# EAGLE design kivezérlés (EAGLE 6.5.0)
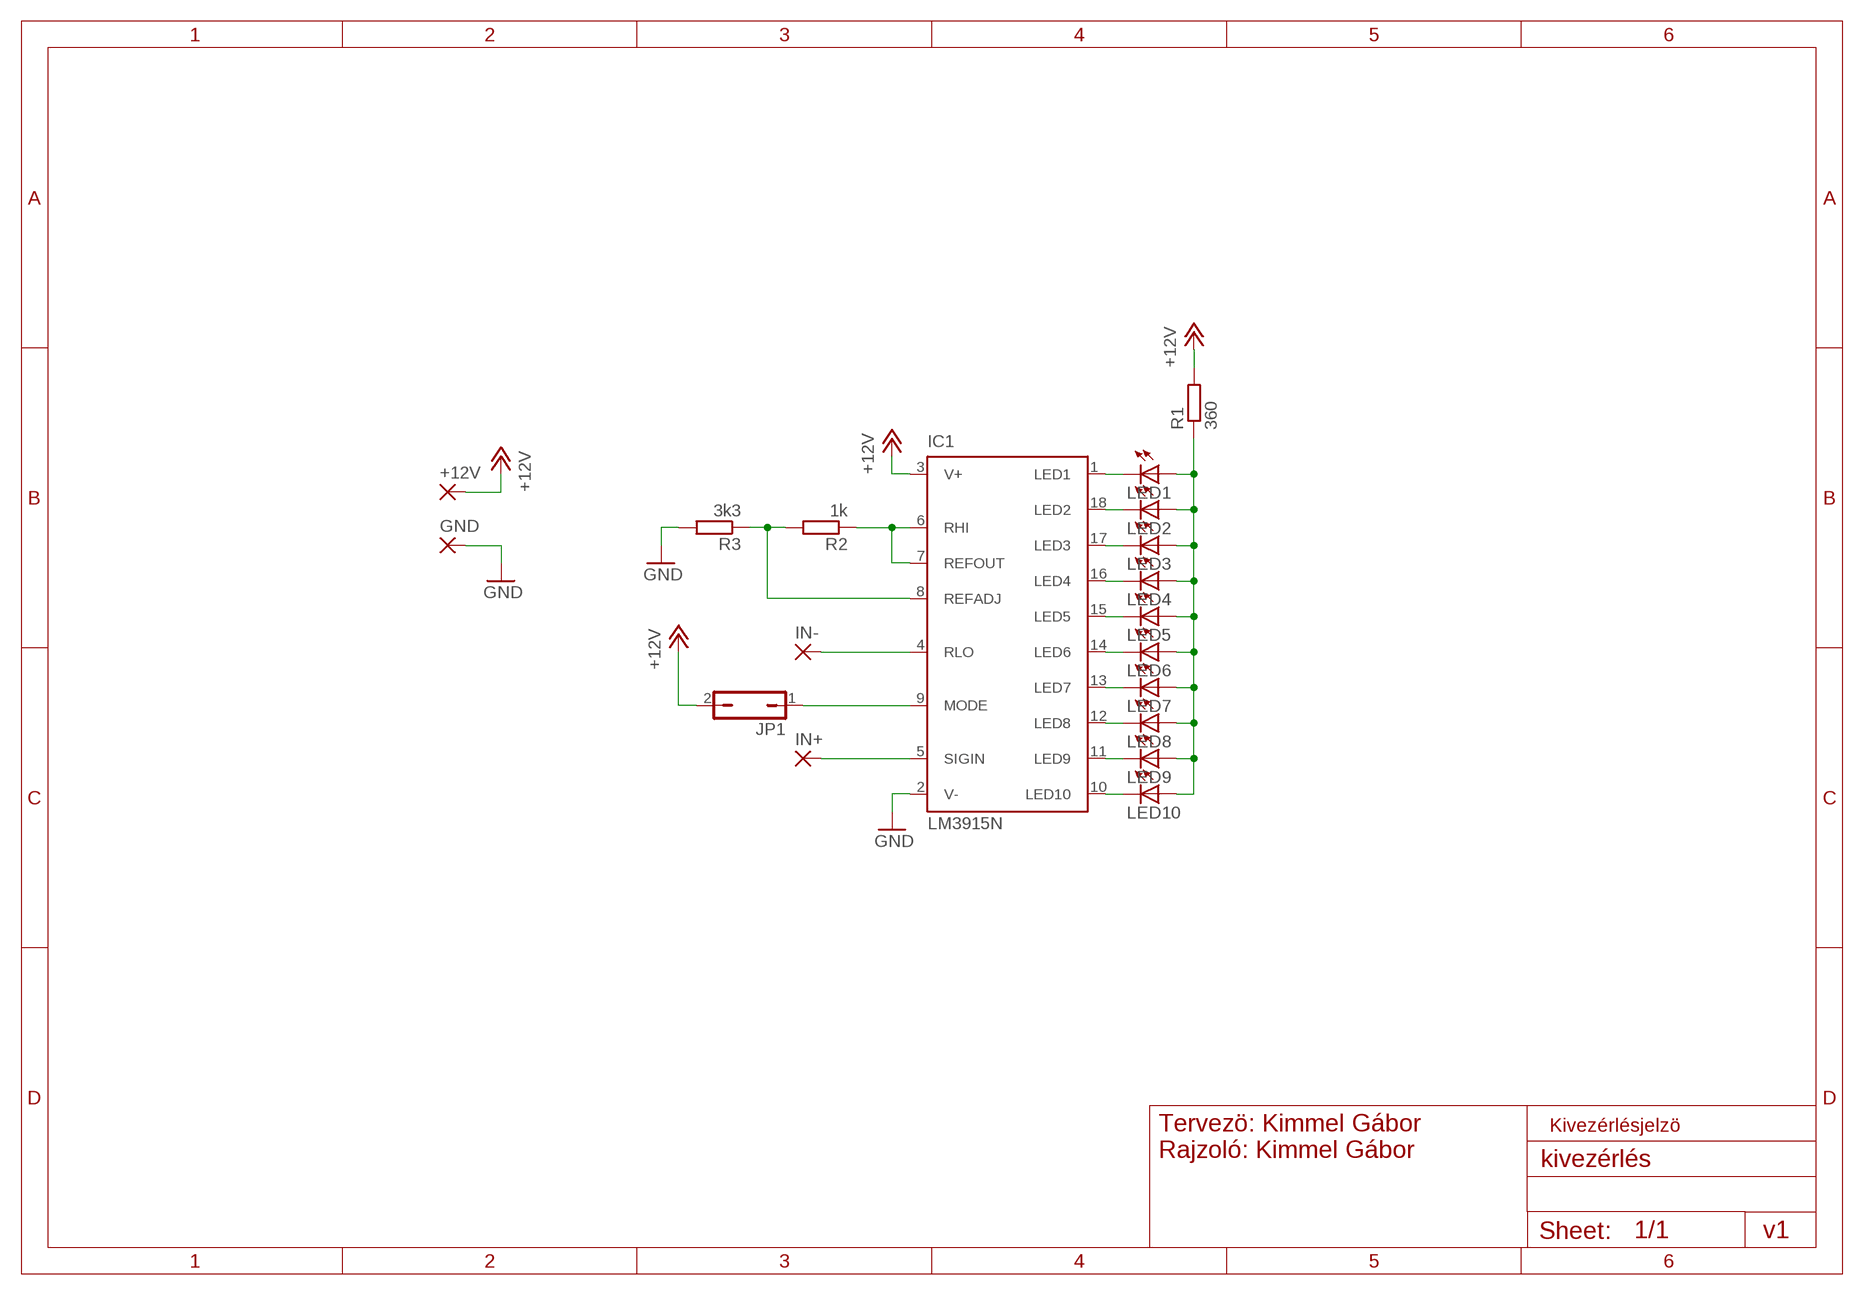
[diagram p0: schematic, sheet 1]

## Parts
+12V  2,15/1,0  [2,15/1,0]
GND  2,15/1,0  [2,15/1,0]
IC1  LM3915N  [DIL18]
IN+  2,15/1,0  [2,15/1,0]
IN-  2,15/1,0  [2,15/1,0]
JP1  JP1Q  [JP1]
LED1  LED5MM  [LED5MM]
LED2  LED5MM  [LED5MM]
LED3  LED5MM  [LED5MM]
LED4  LED5MM  [LED5MM]
LED5  LED5MM  [LED5MM]
LED6  LED5MM  [LED5MM]
LED7  LED5MM  [LED5MM]
LED8  LED5MM  [LED5MM]
LED9  LED5MM  [LED5MM]
LED10  LED5MM  [LED5MM]
R1  360  R-EU_0309/12  [0309/12]
R2  1k  R-EU_0309/12  [0309/12]
R3  3k3  R-EU_0309/12  [0309/12]

## Nets
+12V: +12V.1(P) IC1.3(V+) JP1.2 R1.2
GND: GND.1(P) IC1.2(V-) R3.2
N$1: IC1.9(MODE) JP1.1
N$2: IC1.6(RHI) IC1.7(REFOUT) R2.1
N$3: IC1.8(REFADJ) R2.2 R3.1
N$4: IC1.4(RLO) IN-.1(P)
N$5: IC1.5(SIGIN) IN+.1(P)
N$6: IC1.1(LED1) LED1.K(C)
N$7: IC1.18(LED2) LED2.K(C)
N$8: IC1.17(LED3) LED3.K(C)
N$9: IC1.16(LED4) LED4.K(C)
N$10: IC1.15(LED5) LED5.K(C)
N$11: IC1.14(LED6) LED6.K(C)
N$12: IC1.13(LED7) LED7.K(C)
N$13: IC1.12(LED8) LED8.K(C)
N$14: IC1.11(LED9) LED9.K(C)
N$15: IC1.10(LED10) LED10.K(C)
N$16: LED1.A LED2.A LED3.A LED4.A LED5.A LED6.A LED7.A LED8.A LED9.A LED10.A R1.1

## Notes on the sheet
- Tervezö: Kimmel Gábor
  Rajzoló: Kimmel Gábor
- Kivezérlésjelzö
- v1

## Library data of the parts
+12V GND IN+ IN- = wirepad:2,15/1,0: THROUGH-HOLE PAD
IC1 = national-semiconductor:LM391: Dot/Bar Display Driver Source: Data sheet LM3915 <http://www.national.com/ds/LM/LM3915.pdf> Data sheet LM3914 <http://www.national.com/ds/LM/LM3914.pdf>
JP1 = jumper:JP1Q: JUMPER
LED1-LED10 = led:LED: LED OSRAM: - CHIPLED LG R971, LG N971, LY N971, LG Q971, LY Q971, LO R971, LY R971 LH N974, LH R974 LS Q976, LO Q976, LY Q976 LO Q996 - Hyper CHIPLED LW Q18S LB Q993, LB Q99A, LB R99A - SideLED LS A670, LO A670, LY A670, LG A670, LP A670 LB A673, LV A673, LT A673, LW A673 LH A674 LY A675 LS A676, LA A676, LO A676, LY A676, LW A676 LS A679, LY A679, LG A679 - Hyper Micro SIDELED® LS Y876, LA Y876, LO Y876, LY Y876 LT Y87S - SmartLED LW L88C, LW L88S LB L89C, LB L89S, LG L890 LS L89K, LO L89K, LY L89K LS L896, LA L896, LO L896, LY L896 - TOPLED LS T670, LO T670, LY T670, LG T670, LP T670 LSG T670, LSP T670, LSY T670, LOP T670, LYG T670 LG T671, LOG T671, LSG T671 LB T673, LV T673, LT T673, LW T673 LH T674 LS T676, LA T676, LO T676, LY T676, LB T676, LH T676, LSB T676, LW T676 LB T67C, LV T67C, LT T67C, LS T67K, LO T67K, LY T67K, LW E67C LS E67B, LA E67B, LO E67B, LY E67B, LB E67C, LV E67C, LT E67C LW T67C LS T679, LY T679, LG T679 LS T770, LO T770, LY T770, LG T770, LP T770 LB T773, LV T773, LT T773, LW T773 LH T774 LS E675, LA E675, LY E675, LS T675 LS T776, LA T776, LO T776, LY T776, LB T776 LHGB T686 LT T68C, LB T68C - Hyper Mini TOPLED® LB M676 - Mini TOPLED Santana® LG M470 LS M47K, LO M47K, LY M47K Source: http://www.osram.convergy.de LUXEON: - LUMILED® LXK2-PW12-R00, LXK2-PW12-S00, LXK2-PW14-U00, LXK2-PW14-V00 LXK2-PM12-R00, LXK2-PM12-S00, LXK2-PM14-U00 LXK2-PE12-Q00, LXK2-PE12-R00, LXK2-PE12-S00, LXK2-PE14-T00, LXK2-PE14-U00 LXK2-PB12-K00, LXK2-PB12-L00, LXK2-PB12-M00, LXK2-PB14-N00, LXK2-PB14-P00, LXK2-PB14-Q00 LXK2-PR12-L00, LXK2-PR12-M00, LXK2-PR14-Q00, LXK2-PR14-R00 LXK2-PD12-Q00, LXK2-PD12-R00, LXK2-PD12-S00 LXK2-PH12-R00, LXK2-PH12-S00 LXK2-PL12-P00, LXK2-PL12-Q00, LXK2-PL12-R00 Source: www.luxeon.com KINGBRIGHT: KA-3528ASYC Source: www.kingbright.com
R1-R3 = resistor:R-EU_: RESISTOR, European symbol

## Board
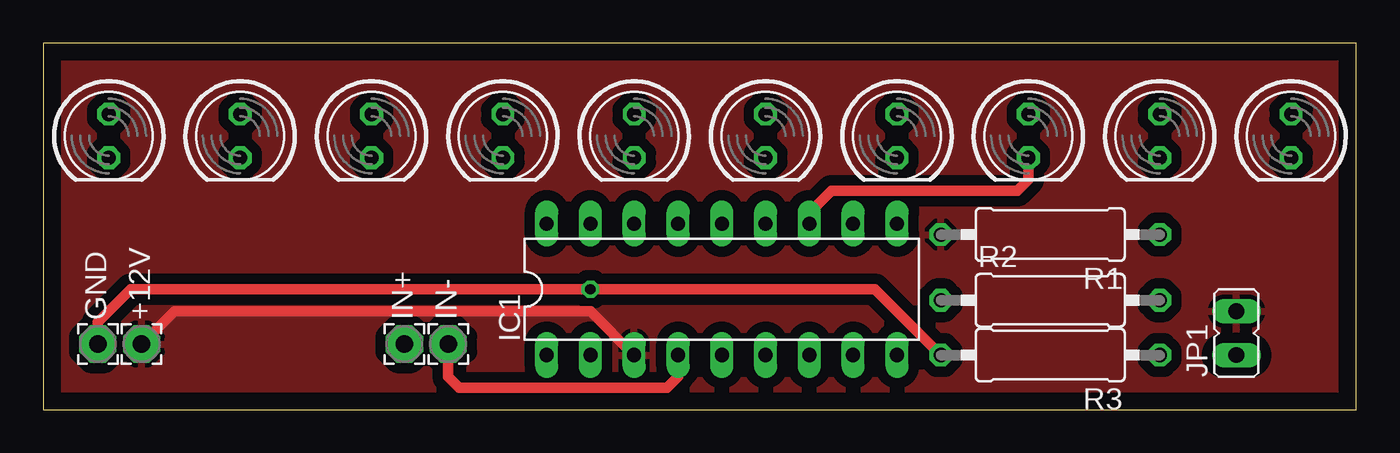
[diagram p1: board, top side]
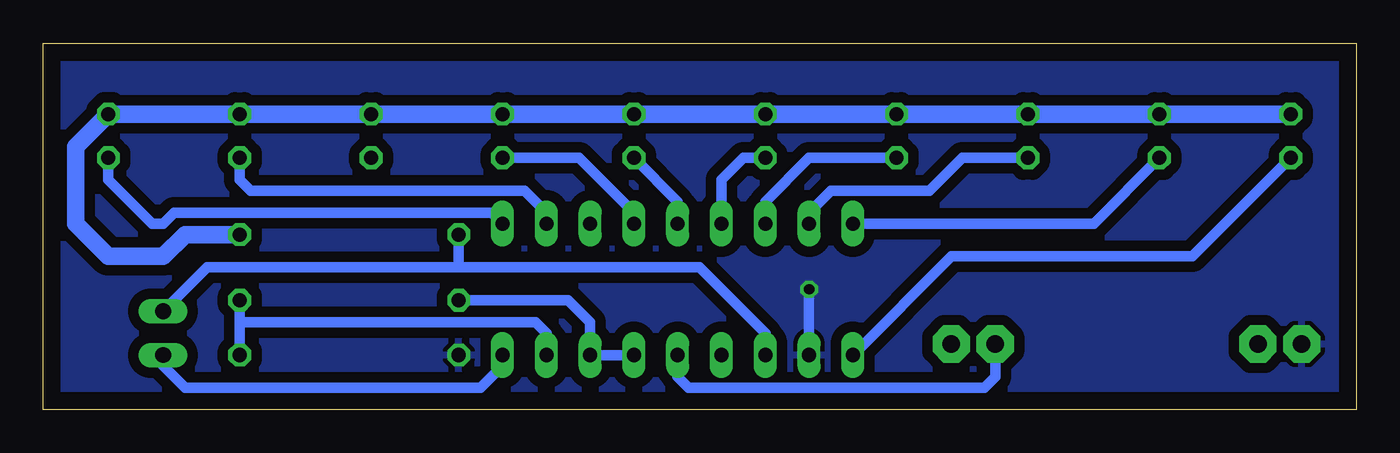
[diagram p2: board, bottom side, seen from below]

Size 76.18 x 21.26 mm. Coordinates in mm from the lower left corner, seen from the top.
Outline: 0,0 76.18,0 76.18,21.26 0,21.26 0,0
Copper layers (1*16): Top 0.035mm / dielectric 1.5mm / Bottom 0.035mm
Design rules "default *": minimum track width 10mil, minimum drill 24mil, track to track 8mil, track to pad 8mil, pad to pad 8mil, via to via 8mil, smd to smd 8mil, copper to edge 40mil, drill to drill 8mil, minimum pad ring 10mil, minimum via ring 8mil, stop-mask expansion 4mil, vias tented up to drill 0mil, thermal gap 10mil

### Footprints (pad centres in the part's own frame; a part is rotated, then mirrored left to right if it is on the bottom)
2,15/1,0 = drill 1.016 pad 2.159 octagon: 1 0,0
DIL18 = drill 0.813 long: 1 -10.16,-3.81; 2 -7.62,-3.81; 3 -5.08,-3.81; 4 -2.54,-3.81; 5 0,-3.81; 6 2.54,-3.81; 7 5.08,-3.81; 8 7.62,-3.81; 9 10.16,-3.81; 10 10.16,3.81; 11 7.62,3.81; 12 5.08,3.81; 13 2.54,3.81; 14 0,3.81; 15 -2.54,3.81; 16 -5.08,3.81; 17 -7.62,3.81; 18 -10.16,3.81
JP1 = drill 0.914 long: 1 0,-1.27; 2 0,1.27
LED5MM = drill 0.813 octagon: A -1.27,0; K 1.27,0
0309/12 = drill 0.813 octagon: 1 -6.35,0; 2 6.35,0

### Placement (x,y rotation side)
+12V  5.71,3.81 0 top
GND  3.17,3.81 0 top
IC1  39.37,6.98 0 top
IN+  20.95,3.81 0 top
IN-  23.5,3.81 0 top
JP1  69.22,4.45 0 top
LED1  3.81,15.88 270 top
LED2  11.43,15.88 270 top
LED3  19.05,15.88 270 top
LED4  26.67,15.88 270 top
LED5  34.29,15.88 270 top
LED6  41.91,15.88 270 top
LED7  49.53,15.88 270 top
LED8  57.15,15.88 270 top
LED9  64.77,15.88 270 top
LED10  72.39,15.88 270 top
R1  58.42,10.16 180 top
R2  58.42,6.35 0 top
R3  58.42,3.18 180 top

### Tracks (layer width: path | path; a pad name or v marks a point on that pad's centre or on a via)
+12V
  Top 0.61: +12V.1 7.62,5.71 31.75,5.71 IC1.3
  Bottom 0.61: IC1.3 34.29,4.45 38.1,8.25 52.07,8.25 | 52.07,8.25 66.67,8.25 JP1.2 | R1.2 52.07,8.25
  pour Top (isolate 0.61): 0,21.59 76.2,21.59 76.2,0 0,0
GND  (via drill 0.6)
  Top 0.61: GND.1 3.17,5.08 5.08,6.98 v31.75,6.98 48.26,6.98 R3.2
  Bottom 0.61: IC1.2 v31.75,6.98
  pour Bottom (isolate 0.61): 0,21.59 76.2,21.59 76.2,0 0,0
N$1
  Bottom 0.61: JP1.1 69.22,2.54 67.94,1.27 50.8,1.27 49.53,2.54 IC1.9
N$2
  Bottom 0.61: R2.1 45.72,6.35 44.45,5.08 IC1.7 IC1.6
N$3
  Bottom 0.61: R3.1 64.77,5.08 | 64.77,5.08 R2.2 | IC1.8 46.99,4.45 47.62,5.08 64.77,5.08
N$4
  Top 0.61: IN-.1 23.5,1.91 24.13,1.27 36.2,1.27 36.83,1.91 IC1.4
N$5
  Bottom 0.61: IC1.5 39.37,1.91 38.73,1.27 21.59,1.27 20.95,1.91 IN+.1
N$6
  Bottom 0.61: LED1.K 9.53,8.89 23.5,8.89 IC1.1
N$7
  Bottom 0.61: IC1.18 15.24,10.8 LED2.K
N$8
  Bottom 0.61: IC1.17 31.75,11.43 30.48,12.7 24.77,12.7 22.86,14.61 LED3.K
N$9
  Bottom 0.61: IC1.16 34.29,12.07 31.75,14.61 LED4.K
N$10
  Bottom 0.61: IC1.15 36.83,13.34 35.56,14.61 LED5.K
N$11
  Bottom 0.61: IC1.14 39.37,12.07 LED6.K
N$12
  Bottom 0.61: IC1.13 41.91,11.43 45.09,14.61 LED7.K
N$13
  Top 0.61: IC1.12 44.45,11.43 45.72,12.7 56.52,12.7 57.15,13.34 LED8.K
N$14
  Bottom 0.61: IC1.11 46.99,11.43 48.26,12.7 64.14,12.7 64.77,13.34 LED9.K
N$15
  Bottom 0.61: LED10.K 72.39,13.34 69.85,10.8 69.22,10.8 68.58,11.43 50.16,11.43 IC1.10
N$16
  Bottom 1.016: LED1.A LED2.A LED3.A LED4.A LED5.A LED6.A LED7.A LED8.A LED9.A LED10.A 74.3,15.24 74.3,10.8 72.39,8.89 69.22,8.89 67.94,10.16 R1.1